# EAGLE design AlteraUSBBlaster2TC (EAGLE 7.4.0)
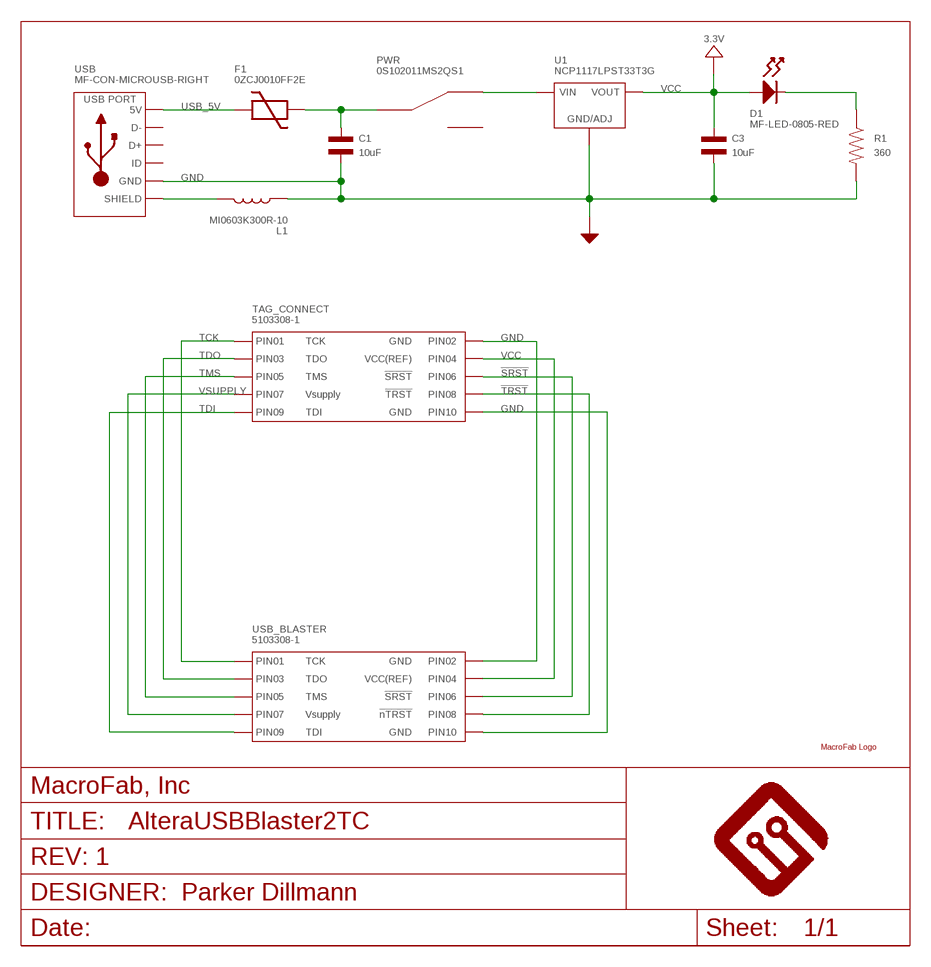
[diagram p0: schematic, sheet 1]

## Parts
C1  10uF  CAPACITOR_NP_1206  [C1206]
C3  10uF  CAPACITOR_NP_1206  [C1206]
D1  MF-LED-0805-RED  LED_SINGLE-0805-RED  [LED0805]
F1  0ZCJ0010FF2E  PTC_FUSE_1206  [1206]
FRAME1  MF_FRAMEDEFAULT  [MF_FRAME_DEFAULT]
L1  MI0603K300R-10  INDUCTOR_0603  [L0603]
PWR  0S102011MS2QS1  SPDT_0S102011MS2QS1  [0S102011MS2QS1]
R1  360  RESISTOR_0805  [R0805]
TAG_CONNECT  5103308-1  CON_02X05_5103308-1  [5103308-1]
U1  NCP1117LPST33T3G  [SOT-223-3]
U$3  MF_LOGOLOGO_MEDIUM  [MF_LOGO_MEDIUM]
USB  MF-CON-MICROUSB-RIGHT  USB_MICRO_RIGHT  [MICROUSB-RIGHT]
USB_BLASTER  5103308-1  CON_02X05_5103308-1  [5103308-1]

## Nets
!SRST: TAG_CONNECT.6(PIN6) USB_BLASTER.6(PIN6)
!TRST: TAG_CONNECT.8(PIN8) USB_BLASTER.8(PIN8)
GND: C1.P$2 C3.P$2 L1.P$1 R1.P$2 TAG_CONNECT.2(PIN2) TAG_CONNECT.10(PIN10) U1.P$2(GND/ADJ) USB.5(GND) USB_BLASTER.2(PIN2) USB_BLASTER.10(PIN10)
N$1: D1.CATHODE R1.P$1
N$2: C1.P$1 F1.2 PWR.2(C)
N$4: L1.P$2 USB.S1(SLD) USB.S2(SLD) USB.S3(SLD) USB.S4(SLD) USB.S5(SLD) USB.S6(SLD)
N$5: PWR.1 U1.P$4(VIN)
TCK: TAG_CONNECT.1(PIN1) USB_BLASTER.1(PIN1)
TDI: TAG_CONNECT.9(PIN9) USB_BLASTER.9(PIN9)
TDO: TAG_CONNECT.3(PIN3) USB_BLASTER.3(PIN3)
TMS: TAG_CONNECT.5(PIN5) USB_BLASTER.5(PIN5)
USB_5V: F1.1 USB.1(5V)
VCC: C3.P$1 D1.ANODE TAG_CONNECT.4(PIN4) U1.P$1(VOUT) U1.P$3(VOUT) USB_BLASTER.4(PIN4) ; supply symbol labelled 3.3V
VSUPPLY: TAG_CONNECT.7(PIN7) USB_BLASTER.7(PIN7)
Unconnected: PWR.3 USB.2(D-) USB.3(D+) USB.4(ID)

## Library data of the parts
C1 C3 = MF_Passives:CAPACITOR_NP: Library: MF_Passives Description: Device for Non-Polarized Capacitors. Manufacture part number (MPN) can be added via Attributes. Check https://factory.macrofab.com/parts for the house parts list.; MPN: MF-CAP-1206-10uF; POPULATE: 1
D1 = MF_LEDs:LED_SINGLE: Library: MF_LEDs Description: Device for Single LED Packages. Manufacture part number (MFG#) can be added via Attributes.; HOUSEPART: YES; MPN: MF-LED-0805-RED; POPULATE: 1; URL: https://factory.macrofab.com/part/MF-LED-0805-RED
F1 = PP_Passives:PTC_FUSE; MPN: 0ZCJ0010FF2E; POPULATE: 1
FRAME1 = MF_Aesthetics:MF_FRAME: Library: MF_Aesthetics Description: Frame for adding Meta Data to the PCB and Schematic.; DNAME: Parker Dillmann; HOUSEPART: 0; POPULATE: 0; REVNUM: REV: 1
L1 = MF_Passives:INDUCTOR: Library: MF_Passives Description: Device for Inductors. Manufacture part number (MPN) can be added via Attributes. Check https://factory.macrofab.com/parts for the house parts list.; MPN: MI0603K300R-10; POPULATE: 1
PWR = PP_Electromechanical:SPDT; MPN: 0S102011MS2QS1; POPULATE: 1
R1 = MF_Passives:RESISTOR: Library: MF_Passives Description: Device for Resistors. Manufacture part number (MPN), Voltage, Tolerance, and Wattage Rating can be added via Attributes. Check https://factory.macrofab.com/parts for the house parts list.; MPN: MF-RES-0805-360; POPULATE: 1
TAG_CONNECT = PP_Connectors:CON_02X05; LABEL01: TCK; LABEL02: GND; LABEL03: TDO; LABEL04: VCC(REF); LABEL05: TMS; LABEL06: !SRST; LABEL07: Vsupply; LABEL08: !TRST; LABEL09: TDI; LABEL10: GND; MPN: 5103308-1; POPULATE: 1
U1 = MF_IC_Power:NCP1117LP: Manufacturer Part #: NCP1117LP Manufacturer: ON Semiconductor Description: LDO Voltage Regulators; HOUSEPART: NO; MPN: NCP1117LPST33T3G; POPULATE: 1; URL: http://www.onsemi.com/pub_link/Collateral/NCP1117LP-D.PDF
U$3 = PP_Aesthetics:MF_LOGO; POPULATE: 0
USB = MF_Connectors:USB: Library: MF_Connectors Description: 5 Pin USB Connectors. SLD is the shield connection. Usually tied to ground through a small ferrite bead.; HOUSEPART: YES; MPN: MF-CON-MICROUSB-RIGHT; POPULATE: 1; URL: https://factory.macrofab.com/part/MF-CON-MICROUSB-RIGHT
USB_BLASTER = PP_Connectors:CON_02X05; LABEL01: TCK; LABEL02: GND; LABEL03: TDO; LABEL04: VCC(REF); LABEL05: TMS; LABEL06: !SRST; LABEL07: Vsupply; LABEL08: !nTRST; LABEL09: TDI; LABEL10: GND; MPN: 5103308-1; POPULATE: 1

## Board
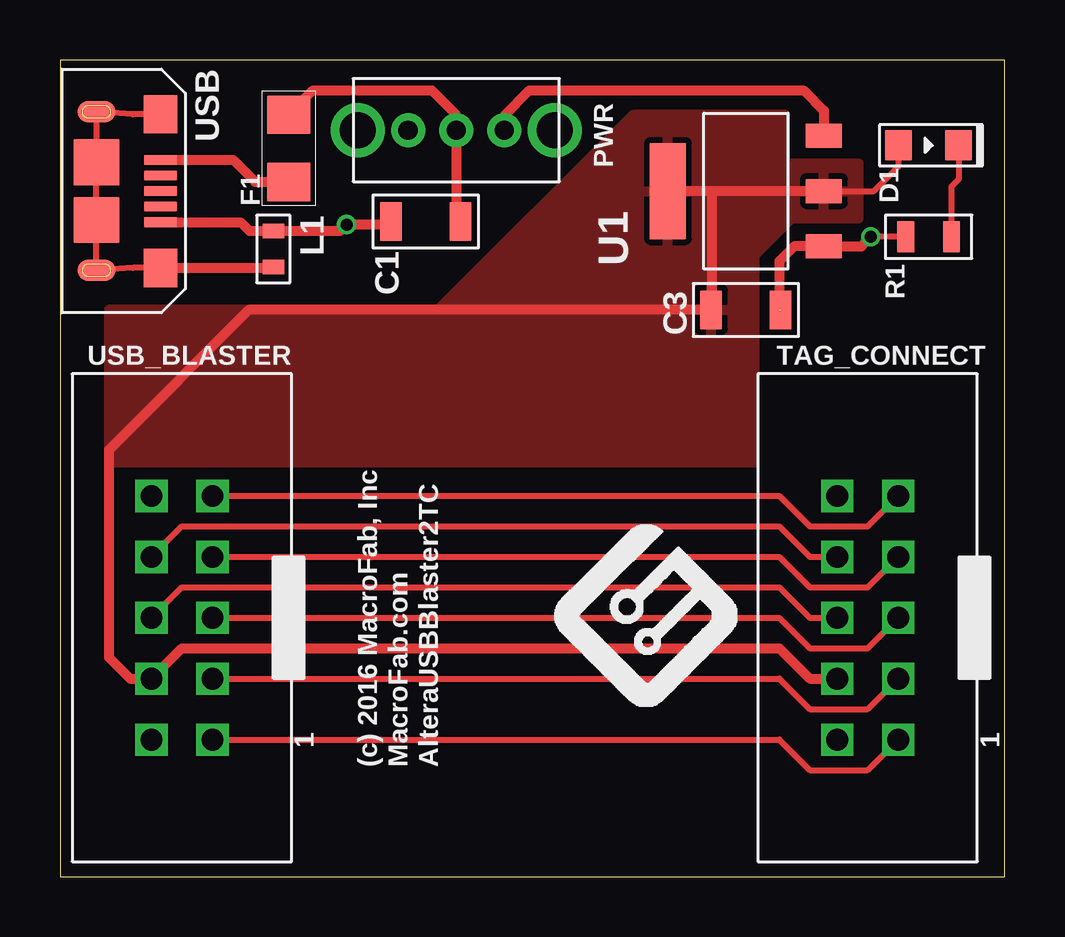
[diagram p1: board, top side]
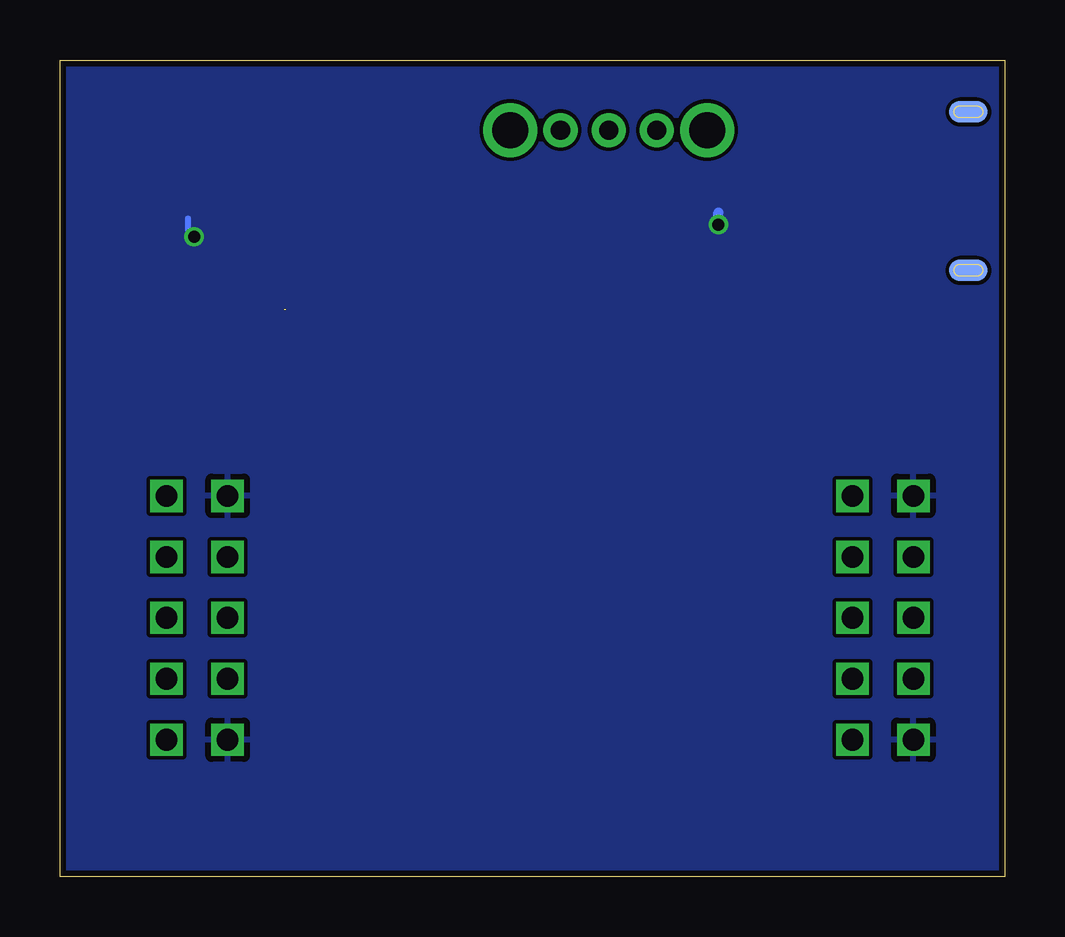
[diagram p2: board, bottom side, seen from below]

Size 39.37 x 34.04 mm. Coordinates in mm from the lower left corner, seen from the top.
Outline: 0,0 39.37,0 39.37,34.04 0,34.04 0,0
Copper layers (1*16): Top 0.035mm / dielectric 1.5mm / Bottom 0.035mm
Design rules "MF_Standard_2_Layer": minimum track width 6mil, minimum drill 12mil, track to track 6mil, track to pad 6mil, pad to pad 6mil, via to via 6mil, smd to smd 0mil, copper to edge 10mil, drill to drill 10mil, minimum pad ring 6mil, minimum via ring 6mil, stop-mask expansion 2mil, vias tented up to drill 25mil, thermal gap 10mil

### Footprints (pad centres in the part's own frame; a part is rotated, then mirrored left to right if it is on the bottom)
C1206 = smd 0.9 x 1.6: P$1 -1.45,0; P$2 1.45,0
LED0805 = smd 1.1 x 1.25: ANODE 1.25,0; CATHODE -1.25,0
1206 = smd 1.6 x 1.8: 1 -1.4,0; 2 1.4,0
L0603 = smd 0.6 x 0.9: P$1 -0.75,0; P$2 0.75,0
0S102011MS2QS1 = drill 0.8 pad 1.422: 1 -2.007,0; 2 0,0; 3 2.007,0 | drill 1.5 pad 2.184: P$4 -4.102,0; P$5 4.102,0
R0805 = smd 0.7 x 1.3: P$1 -0.95,0; P$2 0.95,0
5103308-1 = drill 0.9 square: 1 5.08,1.27; 2 5.08,-1.27; 3 2.54,1.27; 4 2.54,-1.27; 5 0,1.27; 6 0,-1.27; 7 -2.54,1.27; 8 -2.54,-1.27; 9 -5.08,1.27; 10 -5.08,-1.27
SOT-223-3 = smd 1.5 x 4: P$1 3.25,0 | smd 1.5 x 1: P$2 -3.25,2.3; P$3 -3.25,0; P$4 -3.25,-2.3
MICROUSB-RIGHT = smd 0.4 x 1.35: 1 -1.3,1.27; 2 -0.65,1.27; 3 0,1.27; 4 0.65,1.27; 5 1.3,1.27 | smd 0.9 x 1.6: S1 -3.3,-1.4; S2 3.3,-1.4 | smd 1.6 x 1.4: S3 -3.2,1.27; S4 3.2,1.27 | smd 1.9 x 1.9: S5 -1.2,-1.405; S6 1.2,-1.405 | smd 0.9 x 1.6 bottom: S7 -3.3,-1.4; S8 3.3,-1.4

### Placement (x,y rotation side)
C1  15.24,27.3 180 top
C3  28.57,23.62 0 top
D1  36.2,30.48 180 top
F1  9.53,30.35 90 top
FRAME1  11.94,4.57 90 top
L1  8.89,26.16 270 top
PWR  16.51,31.11 180 top
R1  36.2,26.67 180 top
TAG_CONNECT  33.66,10.79 270 top
U1  28.57,28.57 180 top
U$3  28.19,7.11 90 top
USB  2.92,28.57 270 top
USB_BLASTER  5.08,10.79 270 top

### Tracks (layer width: path | path; a pad name or v marks a point on that pad's centre or on a via)
!SRST
  Top 0.254: USB_BLASTER.6 5.08,12.06 29.97,12.06 31.24,10.79 TAG_CONNECT.6
!TRST
  Top 0.254: USB_BLASTER.8 5.08,14.61 29.97,14.61 31.24,13.34 TAG_CONNECT.8
GND  (via drill 0.5)  (1 unrouted)
  Top 0.254: R1.P$2 v33.78,26.67
  Top 0.406: 13.79,27.18 v11.94,27.18 11.67,26.91 L1.P$1 7.89,26.91 7.52,27.27 USB.5 | v33.78,26.67 33.39,26.27 U1.P$2 30.59,26.27 29.97,25.65 29.97,23.62 | 13.84,27.18 13.79,27.18 | 13.79,27.18 C1.P$2
  Bottom 0.254: v33.78,26.67 34.04,26.92 34.04,27.43
  Bottom 0.406: v11.94,27.18 11.94,27.69
  pour Bottom: 0,34.04 39.37,34.04 39.37,0 0,0
N$1
  Top 0.254: D1.CATHODE 37.45,29.06 37.15,28.76 R1.P$1
N$2
  Top 0.406: F1.2 10.54,32.77 15.49,32.77 16.51,31.75 PWR.2 16.51,27.3 C1.P$1
N$4
  Top 0.254: USB.S4 3.04,25.38 USB.S2 1.52,25.53 USB.S6 USB.S5 USB.S1 3.04,31.77 USB.S3
  Top 0.406: USB.S4 8.85,25.38 L1.P$2
N$5
  Top 0.406: PWR.1 18.54,31.14 18.54,31.75 19.56,32.77 30.99,32.77 31.82,31.93 U1.P$4
TCK
  Top 0.254: USB_BLASTER.1 29.97,5.71 31.24,4.45 33.66,4.45 TAG_CONNECT.1
TDI
  Top 0.254: USB_BLASTER.9 29.97,15.88 31.24,14.61 33.66,14.61 TAG_CONNECT.9
TDO
  Top 0.254: USB_BLASTER.3 29.97,8.26 31.24,6.99 33.66,6.99 TAG_CONNECT.3
TMS
  Top 0.254: USB_BLASTER.5 29.97,10.79 31.24,9.53 33.66,9.53 TAG_CONNECT.5
USB_5V
  Top 0.406: USB.1 7.21,29.88 8.13,28.95 F1.1
VCC
  Top 0.254: U1.P$3 33.91,28.57 34.95,29.61 D1.ANODE
  Top 0.406: TAG_CONNECT.4 31.24,8.26 29.97,9.53 5.08,9.53 USB_BLASTER.4 2.92,8.26 2.03,9.14 2.03,17.78 7.87,23.62 C3.P$1 27.18,23.62 27.18,28.57 | U1.P$3 27.18,28.57 | 27.18,28.57 U1.P$1
  pour Top: 30.23,31.75 23.88,31.75 15.75,23.62 2.03,23.62 2.03,17.27 28.96,17.27 28.96,25.91 30.48,27.43 33.27,27.43 33.27,29.72 30.23,29.72
VSUPPLY
  Top 0.254: USB_BLASTER.7 29.97,13.34 31.24,12.06 33.66,12.06 TAG_CONNECT.7